# Altium schematic sheet Power.SchDoc
size A4; SheetNumber: 5; SheetTotal: 5
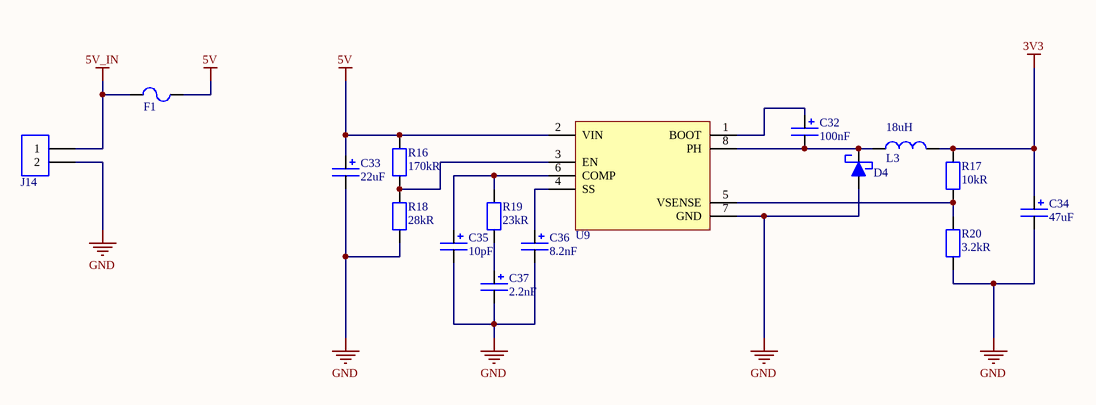
[diagram p0: Power.SchDoc]

## Parts
C32  value 100nF  [CAP 0603]  (hidden comment: CAP 0603)
C33  value 22uF  [CAP 0603]  (hidden comment: CAP 0603)
C34  value 47uF  [CAP 0603]  (hidden comment: CAP 0603)
C35  value 10pF  [CAP 0603]  (hidden comment: CAP 0603)
C36  value 8.2nF  [CAP 0603]  (hidden comment: CAP 0603)
C37  value 2.2nF  [CAP 0603]  (hidden comment: CAP 0603)
D4  1N5819HW-7-F  [SOD123]  (value not drawn)
F1  PTC 1206  [PTC 1206]  (value not drawn)
J14  282845-2  [TERM-21]  (value not drawn)
L3  value 18uH  [IND 6X6]  (hidden comment: NR6028)
R16  value 170kR  [RESISTOR 0603]  (hidden comment: RES 0603)
R17  value 10kR  [RESISTOR 0603]  (hidden comment: RES 0603)
R18  value 28kR  [RESISTOR 0603]  (hidden comment: RES 0603)
R19  value 23kR  [RESISTOR 0603]  (hidden comment: RES 0603)
R20  value 3.2kR  [RESISTOR 0603]  (hidden comment: RES 0603)
U9  TPS54231  [SOIC-8]  (value not drawn)

## Nets
3V3: C34.1 L3.2 R17.2
5V: C33.1 F1.2 R16.2 U9.2(VIN)
5V_IN: F1.1 J14.1
GND: C33.2 C34.2 C35.2 C36.2 C37.2 D4.2 J14.2 R18.1 R20.1 U9.7(GND)
NetC32_1: C32.1 U9.1(BOOT)
NetC32_2: C32.2 D4.1 L3.1 U9.8(PH)
NetC35_1: C35.1 R19.2 U9.6(COMP)
NetC36_1: C36.1 U9.4(SS)
NetC37_1: C37.1 R19.1
NetR16_1: R16.1 R18.2 U9.3(EN)
NetR17_1: R17.1 R20.2 U9.5(VSENSE)

## Notes on the sheet
- Dosya Adı / File Name
- Proje Adı / Project Name
- Sayfa Adı / Sheet Name
- Şirket Adı / Company Name
- Tasarlayan / Designed By
- Takım / Team
- Kontrol Eden / Checked By
- Başlangıç Tarihi / Start Date
- Revize Tarihi / Revision Date
- Onaylayan / Approved By
- Sayfa / Sheet

## Library data of the parts
C32-C37 = CAP 0603: Multilayer Ceramic Capacitor; Capacitor Type: MLCC; Case/Package: 0603
D4 = 1N5819HW-7-F: Diode Schottky; Voltage: 40V; Case/Package: SOD-123; Diode Type: Schottky
F1 = PTC 1206: Fuse
J14 = TERM-21: Screw Terminal; Pin Rows: 1; Pitch: 7.62mm
L3 = NR6028: SMD Inductor
R16-R20 = RES 0603: SMD Chip Resistor; Case/Package: 0603
U9 = TPS54231: Regulator Switch